# Altium schematic sheet modFOC-MCU.SchDoc: modFOC-MCU
size A4; Author: Thomas Hofmann; CompanyName: HTL St.Pölten; Organization: Altium Limited; Address1: modFOC; Address4: Australia 2086; DocumentNumber: 1; Revision: 2.0; SheetNumber: 6; SheetTotal: 7
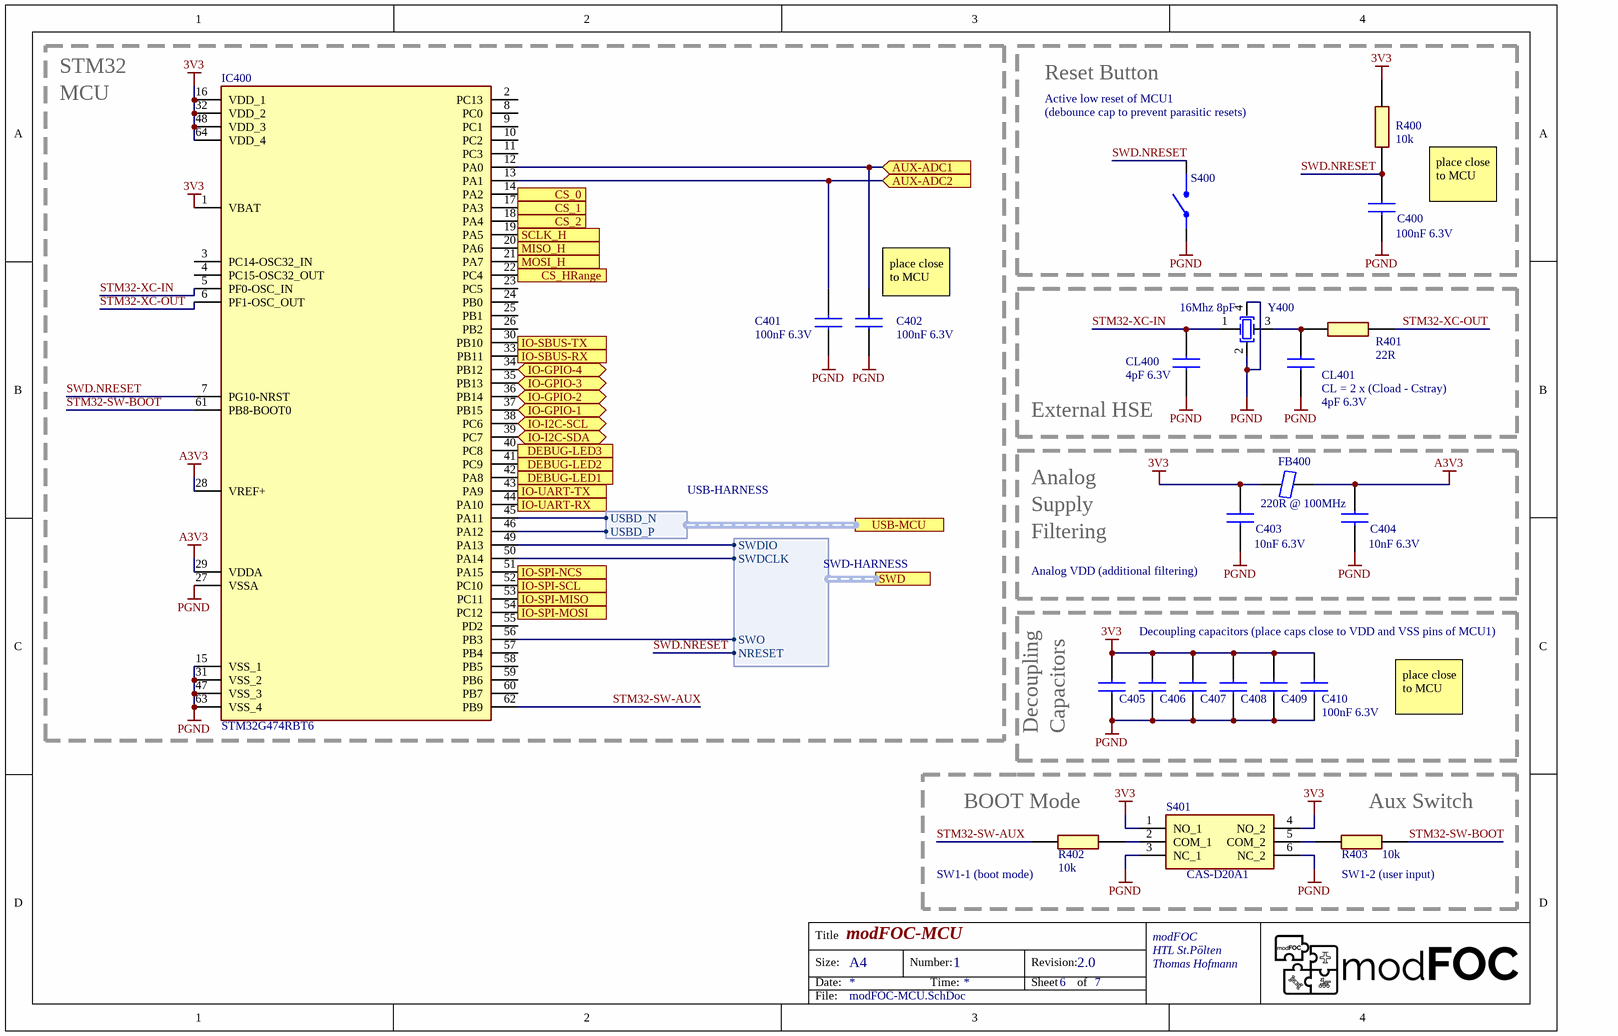
[diagram p0: modFOC-MCU.SchDoc]

## Parts
C400  100nF 6.3V  [CAPC1608X97N]
C401  100nF 6.3V  [CAPC1005X55N]
C402  100nF 6.3V  [CAPC1005X55N]
C403  10nF 6.3V  [CAPC1608X97N]
C404  10nF 6.3V  [CAPC1608X97N]
C405  100nF 6.3V  [CAPC1608X97N]  (value not drawn)
C406  100nF 6.3V  [CAPC1608X97N]  (value not drawn)
C407  100nF 6.3V  [CAPC1608X97N]  (value not drawn)
C408  100nF 6.3V  [CAPC1608X97N]  (value not drawn)
C409  100nF 6.3V  [CAPC1608X97N]  (value not drawn)
C410  100nF 6.3V  [CAPC1608X97N]
CL400  4pF 6.3V  [CAPC1608X97N]
CL401  4pF 6.3V  [CAPC1608X97N]
FB400  220R @ 100MHz  [FB0603]
IC400  STM32G474RBT6  [QFP50P1200X1200X160-64N]
R400  10k  [RESC1608X50N]
R401  22R  [RESC1005X40N]
R402  10k  [RESC1608X50N]
R403  10k  [RESC1608X50N]
S400  434153017835  [434153017835]  (value not drawn)
S401  CAS-D20A1  [CASD20A1]
Y400  16Mhz 8pF  [ABM8W160000MHZ8B1UT3]

## Blocks framed on the sheet
Reset Button: C400 R400 S400
External HSE: CL400 CL401 R401 Y400

## Ports
AUX-ADC1 (in), AUX-ADC2 (in), CS_0 (out), CS_1 (out), CS_2 (out), CS_HRange (out), DEBUG-LED1 (out), DEBUG-LED2 (out), DEBUG-LED3 (out), IO-GPIO-1 (bidir), IO-GPIO-2 (bidir), IO-GPIO-3 (bidir), IO-GPIO-4 (bidir), IO-I2C-SCL (bidir), IO-I2C-SDA (bidir), IO-SBUS-RX (in), IO-SBUS-TX (out), IO-SPI-MISO (in), IO-SPI-MOSI (out), IO-SPI-NCS (out), IO-SPI-SCL (out), IO-UART-RX (in), IO-UART-TX (out), MISO_H (in), MOSI_H (out), SCLK_H (out), SWD (harness SWD-HARNESS), USB-MCU (harness USB-HARNESS)

## Harnesses
USB-HARNESS: USBD_P, USBD_N
SWD-HARNESS: SWDIO, SWDCLK, SWO, NRESET

## Nets
3V3: C403.1 C405.1 C406.1 C407.1 C408.1 C409.1 C410.1 FB400.1 IC400.1(VBAT) IC400.16(VDD_1) IC400.32(VDD_2) IC400.48(VDD_3) IC400.64(VDD_4) R400.1 S401.1(NO_1) S401.4(NO_2)
A3V3: C404.1 FB400.2 IC400.28(VREF+) IC400.29(VDDA)
PGND: C400.2 C401.1 C402.1 C403.2 C404.2 C405.2 C406.2 C407.2 C408.2 C409.2 C410.2 CL400.1 CL401.1 IC400.15(VSS_1) IC400.27(VSSA) IC400.31(VSS_2) IC400.47(VSS_3) IC400.63(VSS_4) S400.1,4(NO) S401.3(NC_1) S401.6(NC_2) Y400.2(OSC2) Y400.4
AUX-ADC1: C402.2 IC400.12(PA0) ; port AUX-ADC1
AUX-ADC2: C401.2 IC400.13(PA1) ; port AUX-ADC2
CS_0: IC400.14(PA2) ; port CS_0
CS_1: IC400.17(PA3) ; port CS_1
CS_2: IC400.18(PA4) ; port CS_2
CS_HRange: IC400.22(PC4) ; port CS_HRange
DEBUG-LED1: IC400.42(PA8) ; port DEBUG-LED1
DEBUG-LED2: IC400.41(PC9) ; port DEBUG-LED2
DEBUG-LED3: IC400.40(PC8) ; port DEBUG-LED3
IO-GPIO-1: IC400.37(PB15) ; port IO-GPIO-1
IO-GPIO-2: IC400.36(PB14) ; port IO-GPIO-2
IO-GPIO-3: IC400.35(PB13) ; port IO-GPIO-3
IO-GPIO-4: IC400.34(PB12) ; port IO-GPIO-4
IO-I2C-SCL: IC400.38(PC6) ; port IO-I2C-SCL
IO-I2C-SDA: IC400.39(PC7) ; port IO-I2C-SDA
IO-SBUS-RX: IC400.33(PB11) ; port IO-SBUS-RX
IO-SBUS-TX: IC400.30(PB10) ; port IO-SBUS-TX
IO-SPI-MISO: IC400.53(PC11) ; port IO-SPI-MISO
IO-SPI-MOSI: IC400.54(PC12) ; port IO-SPI-MOSI
IO-SPI-NCS: IC400.51(PA15) ; port IO-SPI-NCS
IO-SPI-SCL: IC400.52(PC10) ; port IO-SPI-SCL
IO-UART-RX: IC400.44(PA10) ; port IO-UART-RX
IO-UART-TX: IC400.43(PA9) ; port IO-UART-TX
MISO_H: IC400.20(PA6) ; port MISO_H
MOSI_H: IC400.21(PA7) ; port MOSI_H
SCLK_H: IC400.19(PA5) ; port SCLK_H
STM32-SW-AUX: IC400.62(PB9) R402.2
STM32-SW-BOOT: IC400.61(PB8-BOOT0) R403.2
STM32-XC-IN: CL400.2 IC400.5(PF0-OSC_IN) Y400.1(OSC1)
STM32-XC-OUT: IC400.6(PF1-OSC_OUT) R401.2
SWD.NRESET: C400.1 IC400.7(PG10-NRST) R400.2 S400.2,3(COM) ; port SWD.NRESET
NetCL401_2: CL401.2 R401.1 Y400.3
NetIC400_45: IC400.45(PA11) ; port USB-MCU.USBD_N
NetIC400_46: IC400.46(PA12) ; port USB-MCU.USBD_P
NetIC400_49: IC400.49(PA13) ; port SWD.SWDIO
NetIC400_50: IC400.50(PA14) ; port SWD.SWDCLK
NetIC400_56: IC400.56(PB3) ; port SWD.SWO
NetR402_1: R402.1 S401.2(COM_1)
NetR403_1: R403.1 S401.5(COM_2)

Not connected (* = marked no-connect by the designer): IC400 2(PC13) 3(PC14-OSC32_IN) 4(PC15-OSC32_OUT) 8(PC0) 9(PC1) 10(PC2) 11(PC3) 23(PC5) 24(PB0) 25(PB1) 26(PB2) 55(PD2) 57(PB4) 58(PB5) 59(PB6) 60(PB7)

## Notes on the sheet
- STM32
- MCU
- Active low reset of MCU1
- (debounce cap to prevent parasitic resets)
- place close to MCU
- (near C402) place close to MCU
- (near CL401) CL = 2 x (Cload - Cstray)
- Analog
- Supply
- (near C403) Analog VDD (additional filtering)
- Filtering
- Decoupling capacitors (place caps close to VDD and VSS pins of MCU1)
- Decoupling
- (near C405) Capacitors
- (near R402) BOOT Mode
- (near R403) Aux Switch
- (near R402) SW1-1 (boot mode)
- (near R403) SW1-2 (user input)
- Title
- Size:
- Date:
- A4
- Number:
- Time:
- Revision:
- Sheet
- of
- File:

## Library data of the parts
C400 C403-C410 CL400 CL401 = C0603: Capacitor; Height: 0.97
C401 C402 = C0402: Capacitor
FB400 = FB0603: Ferrite Bead; Height: 0.75mm
IC400 = STM32G474RBT6: Integrated Circuit; Manufacturer_Name: STMicroelectronics; Datasheet Link: https://www.mouser.com/datasheet/2/389/stm32g474cb-1600828.pdf; Height: 1.6mm; Manufacturer_Part_Number: STM32G474RBT6; Mouser Part Number: 511-STM32G474RBT6; Mouser Price/Stock: https://www.mouser.co.uk/ProductDetail/STMicroelectronics/STM32G474RBT6?qs=uwxL4vQweFP0uAZUZXLBhQ%3D%3D
R400 R402 R403 = R0603: Resistor; Height: 0.55mm
R401 = R0402: Resistor; Height: 0.4mm
S400 = SW-SPST: Switch
S401 = CAS-D20A1: Switch; Manufacturer_Name: Copal Electronics; Datasheet Link: https://www.nidec-copal-electronics.com/e/catalog/switch/cas.pdf; Height: 2.5mm; Manufacturer_Part_Number: CAS-D20A1
Y400 = ABM8W-16.0000MHZ-8-B1U-T3: Crystal or Oscillator; Manufacturer_Name: ABRACON; Datasheet Link: https://abracon.com/Resonators/ABM8W.pdf; Height: 0.75mm; Manufacturer_Part_Number: ABM8W-16.0000MHZ-8-B1U-T3; Mouser Part Number: 815-8W16-8B1UT; Mouser Price/Stock: https://www.mouser.co.uk/ProductDetail/ABRACON/ABM8W-160000MHZ-8-B1U-T3?qs=5aG0NVq1C4zuwTHNFUIcqw%3D%3D; Arrow Part Number: ABM8W-16.0000MHZ-8-B1U-T3; Arrow Price/Stock: https://www.arrow.com/en/products/abm8w-16.0000mhz-8-b1u-t3/abracon